# EAGLE design 1tm32 (EAGLE 9.6.2)
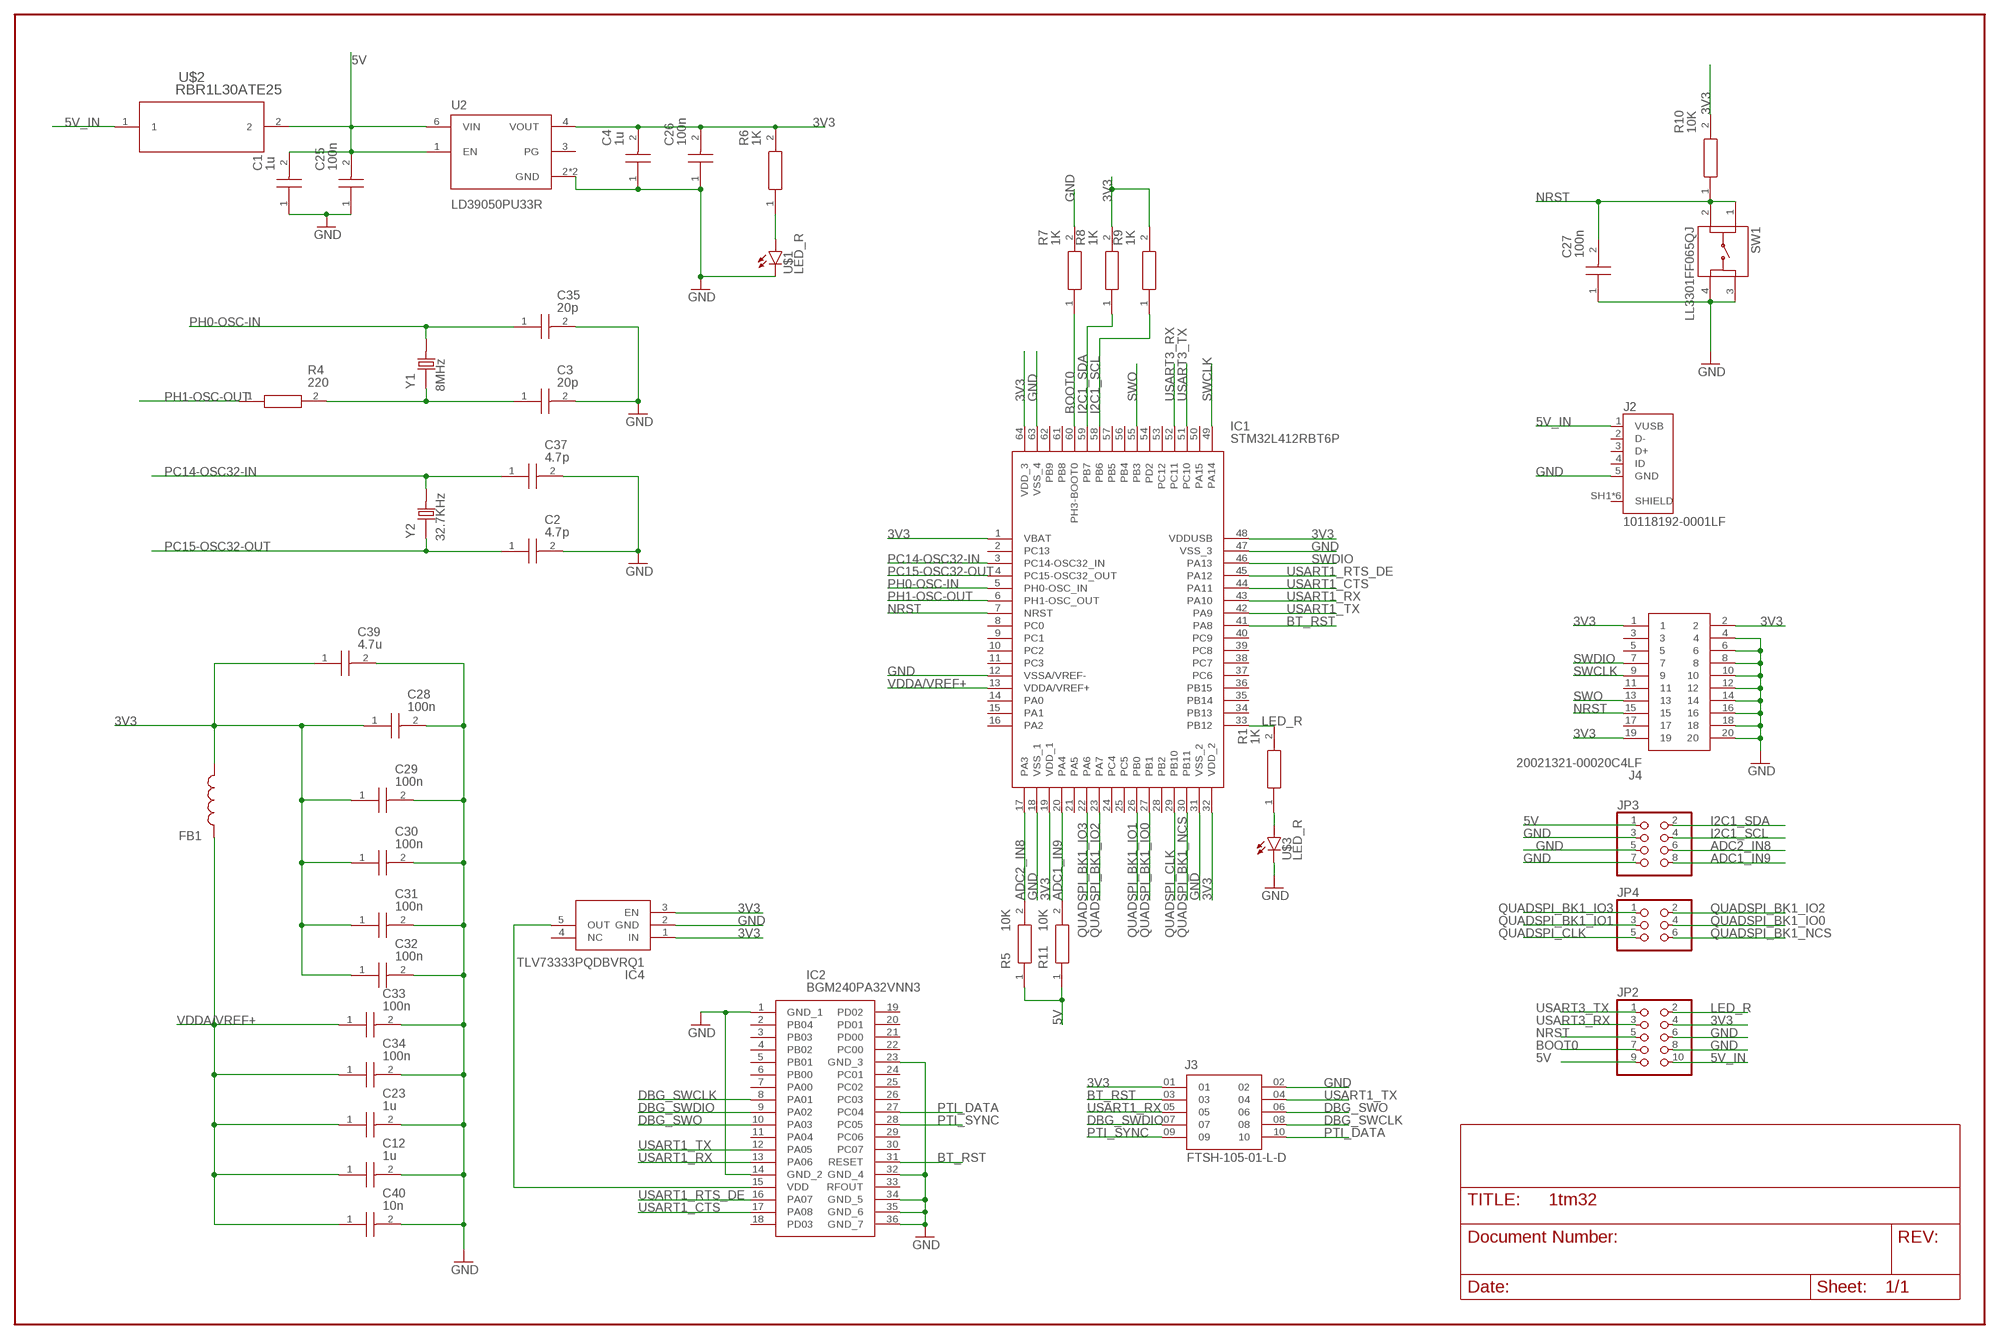
[diagram p0: schematic, sheet 1]

## Parts
C1  1u  GRM219R61H105KA73D  [CAPC2012X95N]
C2  4.7p  GQM2195C2E4R7BB12D  [CAPC2012X100N]
C3  20p  GQM2195G2H200GB12D  [CAPC2012X100N]
C4  1u  GRM219R61H105KA73D  [CAPC2012X95N]
C12  1u  GRM219R61H105KA73D  [CAPC2012X95N]
C23  1u  GRM219R61H105KA73D  [CAPC2012X95N]
C25  100n  GRT31C5C2A104JA12L  [CAPC3216X180N]
C26  100n  GRT31C5C2A104JA12L  [CAPC3216X180N]
C27  100n  GRT31C5C2A104JA12L  [CAPC3216X180N]
C28  100n  GRT31C5C2A104JA12L  [CAPC3216X180N]
C29  100n  GRT31C5C2A104JA12L  [CAPC3216X180N]
C30  100n  GRT31C5C2A104JA12L  [CAPC3216X180N]
C31  100n  GRT31C5C2A104JA12L  [CAPC3216X180N]
C32  100n  GRT31C5C2A104JA12L  [CAPC3216X180N]
C33  100n  GRT31C5C2A104JA12L  [CAPC3216X180N]
C34  100n  GRT31C5C2A104JA12L  [CAPC3216X180N]
C35  20p  GQM2195G2H200GB12D  [CAPC2012X100N]
C37  4.7p  GQM2195C2E4R7BB12D  [CAPC2012X100N]
C39  4.7u  GRT21BC71H475KE13L  [CAPC2012X145N]
C40  10n  GRM31CR73A103KW03L  [CAPC3216X180N]
FB1  BK1608HS601-T  [BEADC1608X95N]
IC1  STM32L412RBT6P  [QFP50P1200X1200X160-64N]
IC2  BGM240PA32VNN3  [BGM240PA32VNN3]
IC4  TLV73333PQDBVRQ1  [SOT95P280X145-5N]
J2  10118192-0001LF  [AMPHENOL_10118192-0001LF]
J3  FTSH-105-01-L-D  [SAMTEC_FTSH-105-01-L-D]
J4  20021321-00020C4LF  [2002132100020C4LF]
JP2  PINHD-2X5  [2X05]
JP3  PINHD-2X4  [2X04]
JP4  PINHD-2X3  [2X03]
R1  1K  RC0805FR-131KL  [RESC2012X60N]
R4  220  RC0805FR-10220RL  [RESC2012X60N]
R5  10K  RC0805JR-0710KL  [RESC2012X60N]
R6  1K  RC0805FR-131KL  [RESC2012X60N]
R7  1K  RC0805FR-131KL  [RESC2012X60N]
R8  1K  RC0805FR-131KL  [RESC2012X60N]
R9  1K  RC0805FR-131KL  [RESC2012X60N]
R10  10K  RC0805JR-0710KL  [RESC2012X60N]
R11  10K  RC0805JR-0710KL  [RESC2012X60N]
SW1  LL3301FF065QJ  [LL3301FF065QJ]
U2  LD39050PU33R  [SON95P300X300X100-7N]
U$1  LED_R  SML-P12VTT86  [LED_SML-P11UTT86R]
U$2  RBR1L30ATE25  [DIO_RBR1L30_ROM]
U$3  LED_R  SML-P12VTT86  [LED_SML-P11UTT86R]
Y1  8MHz  ABLS-8.000MHZ-B2-T  [XTAL_ABLS-8.000MHZ-B2-T]
Y2  32.7KHz  ECS-.327-12.5-12QS-TR  [XTAL_ECS-.327-12.5-12QS-TR]

## Nets
3V3: C4.2 C26.2 C28.1 C29.1 C30.1 C31.1 C32.1 C39.1 FB1.2 IC1.1(VBAT) IC1.19(VDD_1) IC1.32(VDD_2) IC1.48(VDDUSB) IC1.64(VDD_3) IC4.1(IN) IC4.3(EN) J3.01 J4.1 J4.2 J4.19 JP2.4 R6.2 R8.2 R9.2 R10.2 U2.4(VOUT)
5V: C1.2 C25.2 JP2.9 JP3.1 R5.1 R11.1 U2.1(EN) U2.6(VIN) U$2.2
5V_IN: J2.1(VUSB) JP2.10 U$2.1
ADC1_IN9: IC1.20(PA4) JP3.8 R11.2
ADC2_IN8: IC1.17(PA3) JP3.6 R5.2
BOOT0: IC1.60(PH3-BOOT0) JP2.7 R7.1
BT_RST: IC1.41(PA8) IC2.31(RESET) J3.03
DBG_SWCLK: IC2.8(PA01) J3.08
DBG_SWDIO: IC2.9(PA02) J3.07
DBG_SWO: IC2.10(PA03) J3.06
GND: C1.1 C2.2 C3.2 C4.1 C12.2 C23.2 C25.1 C26.1 C27.1 C28.2 C29.2 C30.2 C31.2 C32.2 C33.2 C34.2 C35.2 C37.2 C39.2 C40.2 IC1.12(VSSA/VREF-) IC1.18(VSS_1) IC1.31(VSS_2) IC1.47(VSS_3) IC1.63(VSS_4) IC2.1(GND_1) IC2.14(GND_2) IC2.23(GND_3) IC2.32(GND_4) IC2.34(GND_5) IC2.35(GND_6) IC2.36(GND_7) IC4.2(GND) J2.5(GND) J3.02 J4.4 J4.6 J4.8 J4.10 J4.12 J4.14 J4.16 J4.18 J4.20 JP2.6 JP2.8 JP3.3 JP3.5 JP3.7 R7.2 SW1.3 SW1.4 U2.2(GND) U2.7(GND) U$1.C U$3.C
I2C1_SCL: IC1.58(PB6) JP3.4 R9.1
I2C1_SDA: IC1.59(PB7) JP3.2 R8.1
LED_R: IC1.33(PB12) JP2.2 R1.2
N$2: R1.1 U$3.A
N$3: C3.1 R4.2 Y1.1
N$4: IC2.15(VDD) IC4.5(OUT)
N$5: R6.1 U$1.A
NRST: C27.2 IC1.7(NRST) J4.15 JP2.5 R10.1 SW1.1 SW1.2
PC14-OSC32-IN: C37.1 IC1.3(PC14-OSC32_IN) Y2.2
PC15-OSC32-OUT: C2.1 IC1.4(PC15-OSC32_OUT) Y2.1
PH0-OSC-IN: C35.1 IC1.5(PH0-OSC_IN) Y1.2
PH1-OSC-OUT: IC1.6(PH1-OSC_OUT) R4.1
PTI_DATA: IC2.27(PC04) J3.10
PTI_SYNC: IC2.28(PC05) J3.09
QUADSPI_BK1_IO0: IC1.27(PB1) JP4.4
QUADSPI_BK1_IO1: IC1.26(PB0) JP4.3
QUADSPI_BK1_IO2: IC1.23(PA7) JP4.2
QUADSPI_BK1_IO3: IC1.22(PA6) JP4.1
QUADSPI_BK1_NCS: IC1.30(PB11) JP4.6
QUADSPI_CLK: IC1.29(PB10) JP4.5
SWCLK: IC1.49(PA14) J4.9
SWDIO: IC1.46(PA13) J4.7
SWO: IC1.55(PB3) J4.13
USART1_CTS: IC1.44(PA11) IC2.17(PA08)
USART1_RTS_DE: IC1.45(PA12) IC2.16(PA07)
USART1_RX: IC1.43(PA10) IC2.13(PA06) J3.05
USART1_TX: IC1.42(PA9) IC2.12(PA05) J3.04
USART3_RX: IC1.52(PC11) JP2.3
USART3_TX: IC1.51(PC10) JP2.1
VDDA/VREF+: C12.1 C23.1 C33.1 C34.1 C40.1 FB1.1 IC1.13(VDDA/VREF+)
Unconnected: IC1.2(PC13) IC1.8(PC0) IC1.9(PC1) IC1.10(PC2) IC1.11(PC3) IC1.14(PA0) IC1.15(PA1) IC1.16(PA2) IC1.21(PA5) IC1.24(PC4) IC1.25(PC5) IC1.28(PB2) IC1.34(PB13) IC1.35(PB14) IC1.36(PB15) IC1.37(PC6) IC1.38(PC7) IC1.39(PC8) IC1.40(PC9) IC1.50(PA15) IC1.53(PC12) IC1.54(PD2) IC1.56(PB4) IC1.57(PB5) IC1.61(PB8) IC1.62(PB9) IC2.2(PB04) IC2.3(PB03) IC2.4(PB02) IC2.5(PB01) IC2.6(PB00) IC2.7(PA00) IC2.11(PA04) IC2.18(PD03) IC2.19(PD02) IC2.20(PD01) IC2.21(PD00) IC2.22(PC00) IC2.24(PC01) IC2.25(PC02) IC2.26(PC03) IC2.29(PC06) IC2.30(PC07) IC2.33(RFOUT) IC4.4(NC) J2.2(D-) J2.3(D+) J2.4(ID) J2.SH1(SHIELD) J2.SH2(SHIELD) J2.SH3(SHIELD) J2.SH4(SHIELD) J2.SH5(SHIELD) J2.SH6(SHIELD) J4.3 J4.5 J4.11 J4.17 U2.3(PG)

## Library data of the parts
C1 C4 C12 C23 = GRM219R61H105KA73D(1u):GRM219R61H105KA73D: MURATA - GRM219R61H105KA73D - CAP, MLCC, X5R, 1UF, 50V, 0805 Source: Datasheet <https://datasheet.datasheetarchive.com/originals/distributors/DKDS-10/191852.pdf>; DESCRIPTION: MURATA - GRM219R61H105KA73D - CAP, MLCC, X5R, 1UF, 50V, 0805; HEIGHT: 0.95mm; MANUFACTURER_NAME: Murata Electronics; MANUFACTURER_PART_NUMBER: GRM219R61H105KA73D; MOUSER_PART_NUMBER: 81-GRM219R61H105KA3D; MOUSER_PRICE-STOCK: https://www.mouser.co.uk/ProductDetail/Murata-Electronics/GRM219R61H105KA73D?qs=O5cugoO6nweiD1nCQ5vS9w%3D%3D
C2 C37 = GQM2195C2E4R7BB12D(4_7p):GQM2195C2E4R7BB12D: Capacitor GQM21 L=2.0mm W=1.25mm T=0.85mm Source: Datasheet <https://psearch.en.murata.com/capacitor/product/GQM2195C2E4R7BB12#.html>; DESCRIPTION: Capacitor GQM21 L=2.0mm W=1.25mm T=0.85mm; HEIGHT: 1mm; MANUFACTURER_NAME: Murata Electronics; MANUFACTURER_PART_NUMBER: GQM2195C2E4R7BB12D; MOUSER_PART_NUMBER: 81-GQM2195C2E4R7BB2D; MOUSER_PRICE-STOCK: https://www.mouser.co.uk/ProductDetail/Murata-Electronics/GQM2195C2E4R7BB12D?qs=0JbGSuRBwBOIE8NOw5EJ%2FA%3D%3D
C3 C35 = GQM2195G2H200GB12D(20p):GQM2195G2H200GB12D: Capacitor GQM21 L=2.0mm W=1.25mm T=0.85mm Source: Datasheet <https://componentsearchengine.com/Datasheets/1/GQM2195G2H200GB12D.pdf>; DESCRIPTION: Capacitor GQM21 L=2.0mm W=1.25mm T=0.85mm; HEIGHT: 1mm; MANUFACTURER_NAME: Murata Electronics; MANUFACTURER_PART_NUMBER: GQM2195G2H200GB12D; MOUSER_PART_NUMBER: 81-GQM2195G2H200GB2D; MOUSER_PRICE-STOCK: https://www.mouser.com/Search/Refine.aspx?Keyword=81-GQM2195G2H200GB2D
C25-C34 = GRT31C5C2A104JA12L(0_1u):GRT31C5C2A104JA12L: Multilayer Ceramic Capacitors MLCC - SMD/SMT Source: Datasheet <https://www.murata.com/en-eu/products/productdetail?partno=GRT31C5C2A104JA12#>; DESCRIPTION: Multilayer Ceramic Capacitors MLCC - SMD/SMT; HEIGHT: 1.8mm; MANUFACTURER_NAME: Murata Electronics; MANUFACTURER_PART_NUMBER: GRT31C5C2A104JA12L; MOUSER_PART_NUMBER: 81-GRT31C5C2A104JA2L; MOUSER_PRICE-STOCK: https://www.mouser.co.uk/ProductDetail/Murata-Electronics/GRT31C5C2A104JA12L?qs=rI7uf1IzohSpYGEFBFd58g%3D%3D
C39 = GRT21BC71H475KE13L(4_7u):GRT21BC71H475KE13L: GRT21BC71H475KE13_ (0805, X7S:EIA, 4.7uF, DC50V) Source: Datasheet <https://search.murata.co.jp/Ceramy/image/img/A01X/G101/ENG/GRT21BC71H475KE13-01.pdf>; DESCRIPTION: GRT21BC71H475KE13_ (0805, X7S:EIA, 4.7uF, DC50V); HEIGHT: 1.45mm; MANUFACTURER_NAME: Murata Electronics; MANUFACTURER_PART_NUMBER: GRT21BC71H475KE13L; MOUSER_PART_NUMBER: 81-GRT21BC71H475KE3L; MOUSER_PRICE-STOCK: https://www.mouser.co.uk/ProductDetail/Murata-Electronics/GRT21BC71H475KE13L?qs=rI7uf1IzohQrtwc9u30k7A%3D%3D
C40 = GRM31CR73A103KW03L(0_01u):GRM31CR73A103KW03L: Murata 3216 GRM 10000pF Ceramic Multilayer Capacitor, 1000 V dc, +125C, X7R Dielectric, +/-10% Source: Datasheet <https://datasheet.datasheetarchive.com/originals/distributors/DKDS-10/192419.pdf>; DESCRIPTION: Murata 3216 GRM 10000pF Ceramic Multilayer Capacitor, 1000 V dc, +125C, X7R Dielectric, +/-10%; HEIGHT: 1.8mm; MANUFACTURER_NAME: Murata Electronics; MANUFACTURER_PART_NUMBER: GRM31CR73A103KW03L; MOUSER_PART_NUMBER: 81-GRM31CR73A103KW3L; MOUSER_PRICE-STOCK: https://www.mouser.co.uk/ProductDetail/Murata-Electronics/GRM31CR73A103KW03L?qs=hNud%2FORuBR1TymPCs4fJcA%3D%3D
FB1 = ce-capstone:BK1608HS601-T: Ferrite Chip Bead(Lead Free) Source: Datasheet <https://www.tai-tech.com.tw/_upload/files/FCM1608-Series.pdf>; DESCRIPTION: Ferrite Chip Bead(Lead Free); HEIGHT: 0.95mm; MANUFACTURER_NAME: Taiyo Yuden; MANUFACTURER_PART_NUMBER: BK1608HS601-T
IC1 = STM32L412RBT6P:STM32L412RBT6P: ARM Microcontrollers - MCU Source: Datasheet <https://www.st.com/resource/en/datasheet/stm32l412c8.pdf>; DESCRIPTION: ARM Microcontrollers - MCU; HEIGHT: 1.6mm; MANUFACTURER_NAME: STMicroelectronics; MANUFACTURER_PART_NUMBER: STM32L412RBT6P; MOUSER_PART_NUMBER: 511-STM32L412RBT6P; MOUSER_PRICE-STOCK: https://www.mouser.co.uk/ProductDetail/STMicroelectronics/STM32L412RBT6P?qs=l7cgNqFNU1hh%252BU1wOZs5Xg%3D%3D
IC2 = BGM240PA32VNN3(bluetooth):BGM240PA32VNN3: Bluetooth Modules - 802.15.1 Bluetooth Module, PCB, Secure Vault Mid, +20 dBm, 2.4 GHz, 1.5 MB , -40 to 105 C, RF Pin, Production, Certified Source: Datasheet; DESCRIPTION: Bluetooth Modules - 802.15.1 Bluetooth Module, PCB, Secure Vault Mid, +20 dBm, 2.4 GHz, 1.5 MB , -40 to 105 C, RF Pin, Production, Certified; HEIGHT: 2.35mm; MANUFACTURER_NAME: Silicon Labs; MANUFACTURER_PART_NUMBER: BGM240PA32VNN3; MOUSER_PART_NUMBER: 634-BGM240PA32VNN3; MOUSER_PRICE-STOCK: https://www.mouser.co.uk/ProductDetail/Silicon-Labs/BGM240PA32VNN3?qs=vvQtp7zwQdOhCUYZDQ7aSw%3D%3D
IC4 = TLV73333PQDBVRQ1(volt_reg2):TLV73333PQDBVRQ1: Automotive capacitor-free 300-mA LDO regulator with foldback current limit for portable devices Source: Datasheet <http://www.ti.com/lit/gpn/TLV733P-Q1>; DESCRIPTION: Automotive capacitor-free 300-mA LDO regulator with foldback current limit for portable devices; HEIGHT: 1.45mm; MANUFACTURER_NAME: Texas Instruments; MANUFACTURER_PART_NUMBER: TLV73333PQDBVRQ1; MOUSER_PART_NUMBER: 595-TLV73333PQDBVRQ1; MOUSER_PRICE-STOCK: https://www.mouser.co.uk/ProductDetail/Texas-Instruments/TLV73333PQDBVRQ1?qs=9r4v7xj2LnnYANXVL3PB4Q%3D%3D
J2 = ce-capstone:10118192-0001LF: Single Port 5 Contact Horizontal Right Angle Shielded Micro B USB 2.0 Connector; AVAILABILITY: Unavailable; DESCRIPTION: USB - micro B USB 2.0 Receptacle Connector 5 Position Surface Mount, Right Angle; MF: Amphenol ICC; MP: 10118192-0001LF; PACKAGE: None; PRICE: None
J3 = FTSH-105-01-L-D(bt_connect):FTSH-105-01-L-D; MANUFACTURER: SAMTEC; PARTREV: B; STANDARD: Manufacturer Recommendations
J4 = 20021321-00020C4LF(20head):20021321-00020C4LF: Minitek127, Board to Board connectors, PCB mounted Receptacle, Vertical, Surface Mount, Double Row, 20 Positions, 1.27mm (0.05inch) pitch Source: Datasheet <https://cdn.amphenol-cs.com/media/wysiwyg/files/drawing/20021321.pdf>; DESCRIPTION: Minitek127, Board to Board connectors, PCB mounted Receptacle, Vertical, Surface Mount, Double Row, 20 Positions, 1.27mm (0.05inch) pitch; HEIGHT: 4.75mm; MANUFACTURER_NAME: Amphenol Communication Solutions; MANUFACTURER_PART_NUMBER: 20021321-00020C4LF; MOUSER_PART_NUMBER: 649-202132100020C4LF; MOUSER_PRICE-STOCK: https://www.mouser.co.uk/ProductDetail/Amphenol-FCI/20021321-00020C4LF?qs=iIVTEDlrHA2zvZ%252BdjBnqqg%3D%3D
JP2 = pinhead:PINHD-2X5: PIN HEADER
JP3 = pinhead:PINHD-2X4: PIN HEADER
JP4 = pinhead:PINHD-2X3: PIN HEADER
R1 R6-R9 = RC0805FR-131KL:RC0805FR-131KL: Thick Film Resistors - SMD 1 kOhms 250 mW 0805 1% Source: Datasheet <https://datasheet.datasheetarchive.com/originals/distributors/Datasheets_SAMA/902f9e387b938f871d31120f5fc1d65e.pdf>; DESCRIPTION: Thick Film Resistors - SMD 1 kOhms 250 mW 0805 1%; HEIGHT: 0.6mm; MANUFACTURER_NAME: KEMET; MANUFACTURER_PART_NUMBER: RC0805FR-131KL; MOUSER_PART_NUMBER: 603-RC0805FR-131KL; MOUSER_PRICE-STOCK: https://www.mouser.co.uk/ProductDetail/YAGEO/RC0805FR-131KL?qs=m6lXFsvg5e0qJLgmV7HC3Q%3D%3D
R4 = RC0805FR-10220RL:RC0805FR-10220RL: Thick Film Resistors - SMD 220 OHM 1% Source: Datasheet; DESCRIPTION: Thick Film Resistors - SMD 220 OHM 1%; HEIGHT: 0.6mm; MANUFACTURER_NAME: KEMET; MANUFACTURER_PART_NUMBER: RC0805FR-10220RL; MOUSER_PART_NUMBER: 603-RC0805FR-10220RL; MOUSER_PRICE-STOCK: https://www.mouser.co.uk/ProductDetail/YAGEO/RC0805FR-10220RL?qs=m6lXFsvg5e0JpfeoSKi9%252BQ%3D%3D
R5 R10 R11 = RC0805JR-0710KL:RC0805JR-0710KL: YAGEO - RC0805JR-0710KL - SMD Chip Resistor, 0805 [2012 Metric], 10 kohm, RC Series, 150 V, Thick Film, 125 mW Source: Datasheet <https://datasheet.datasheetarchive.com/originals/distributors/Datasheets_SAMA/902f9e387b938f871d31120f5fc1d65e.pdf>; DESCRIPTION: YAGEO - RC0805JR-0710KL - SMD Chip Resistor, 0805 [2012 Metric], 10 kohm, RC Series, 150 V, Thick Film, 125 mW; HEIGHT: 0.6mm; MANUFACTURER_NAME: KEMET; MANUFACTURER_PART_NUMBER: RC0805JR-0710KL; MOUSER_PART_NUMBER: 603-RC0805JR-0710KL; MOUSER_PRICE-STOCK: https://www.mouser.co.uk/ProductDetail/YAGEO/RC0805JR-0710KL?qs=ZFGQJeMQzF5q%2Fp77vM%2FrVQ%3D%3D
SW1 = ce-capstone:LL3301FF065QJ: Pushbutton Switches 50mA 12VDC F065 7.0mm J-Lead Source: Datasheet <https://componentsearchengine.com/Datasheets/1/LL3301FF065QJ.pdf>; DESCRIPTION: Pushbutton Switches 50mA 12VDC F065 7.0mm J-Lead; HEIGHT: 7.3mm; MANUFACTURER_NAME: E-Switch; MANUFACTURER_PART_NUMBER: LL3301FF065QJ; MOUSER_PART_NUMBER: 612-LL3301FF065QJ; MOUSER_PRICE-STOCK: https://www.mouser.com/Search/Refine.aspx?Keyword=612-LL3301FF065QJ
U2 = ce-capstone:LD39050PU33R: LD39050 Series 500 mA 3.3 V Fixed Low Noise LDO Voltage Regulator - DFN-6; AVAILABILITY: Unavailable; DESCRIPTION: Linear Voltage Regulator IC 1 Output 500mA 6-DFN _3x3_; MF: STMicroelectronics; MP: LD39050PU33R; PACKAGE: DFN-6 STMicroelectronics; PRICE: None
U$1 U$3 = ce-capstone:SML-P12VTT86: SML-P1 Series Red 0402 Clear 60 mcd 2 V Surface Mount PICOLED LED; AVAILABILITY: Unavailable; DESCRIPTION: Red 630nm LED Indication - Discrete 2V 0402 _1006 Metric_; MF: Rohm; MP: SML-P12VTT86; PACKAGE: 0402 Rohm; PRICE: None
U$2 = RBR1L30ATE25(scho_diode):RBR1L30ATE25; COPYRIGHT: Copyright (C) 2023 Ultra Librarian. All rights reserved.; DIGI-KEY_PART_NUMBER_1: RBR1L30ATE25CT-ND; DIGI-KEY_PART_NUMBER_2: RBR1L30ATE25DKR-ND; DIGI-KEY_PART_NUMBER_3: RBR1L30ATE25TR-ND; MANUFACTURER_PART_NUMBER: RBR1L30ATE25; MFR_NAME: ROHM Semiconductor
Y1 = ce-capstone:ABLS-8.000MHZ-B2-T: Crystal 8MHz Â±20ppm (Tol) Â±50ppm (Stability) 18pF FUND 80Ohm 2-Pin HC-49/US SMD T/R; AVAILABILITY: Unavailable; DESCRIPTION: 8MHz ±20ppm Crystal 18pF 80 Ohms HC-49/US; MF: Abracon LLC; MP: ABLS-8.000MHZ-B2; PACKAGE: HC-49/US Abracon LLC; PRICE: None
Y2 = ce-capstone:ECS-.327-12.5-12QS-TR: SMD CRYSTAL 32.768 KHz; AVAILABILITY: Unavailable; DESCRIPTION: 32.768kHz ±20ppm Crystal 12.5pF 90 kOhms 2-SMD, No Lead; MF: ECS Inc.; MP: ECS-.327-12.5-12QS-TR; PACKAGE: SMD-2 ECS International; PRICE: None

## Board
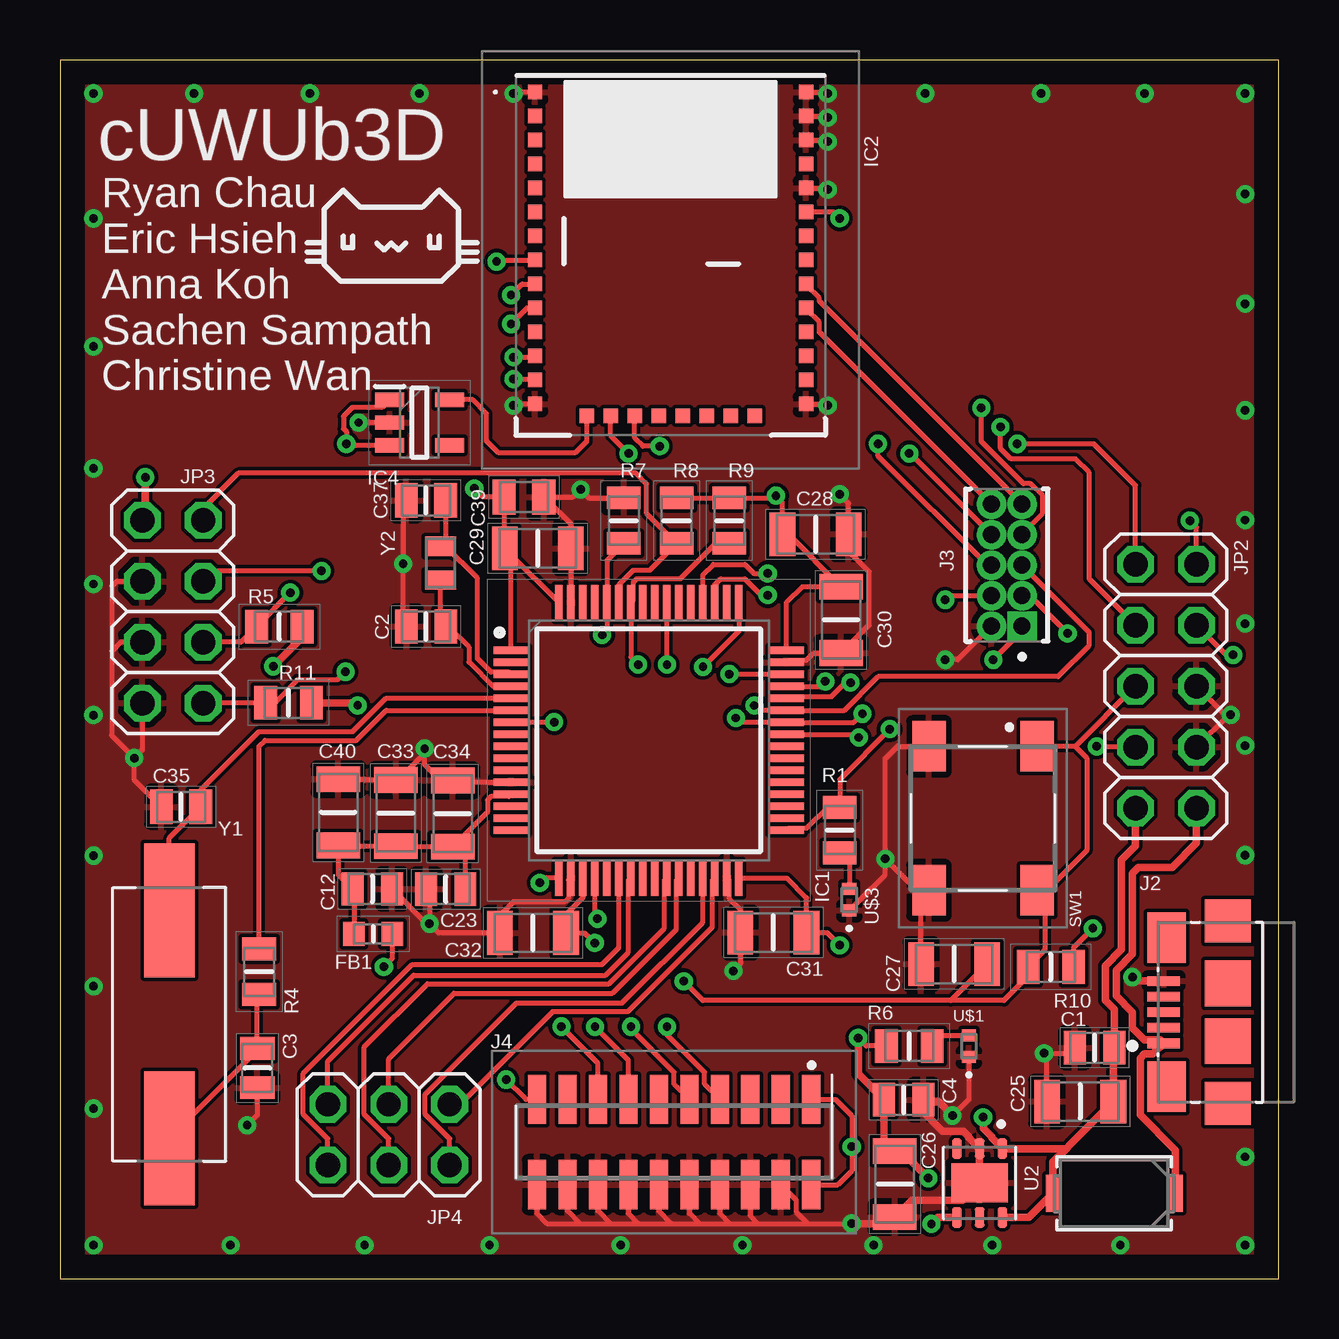
[diagram p1: board, top side]
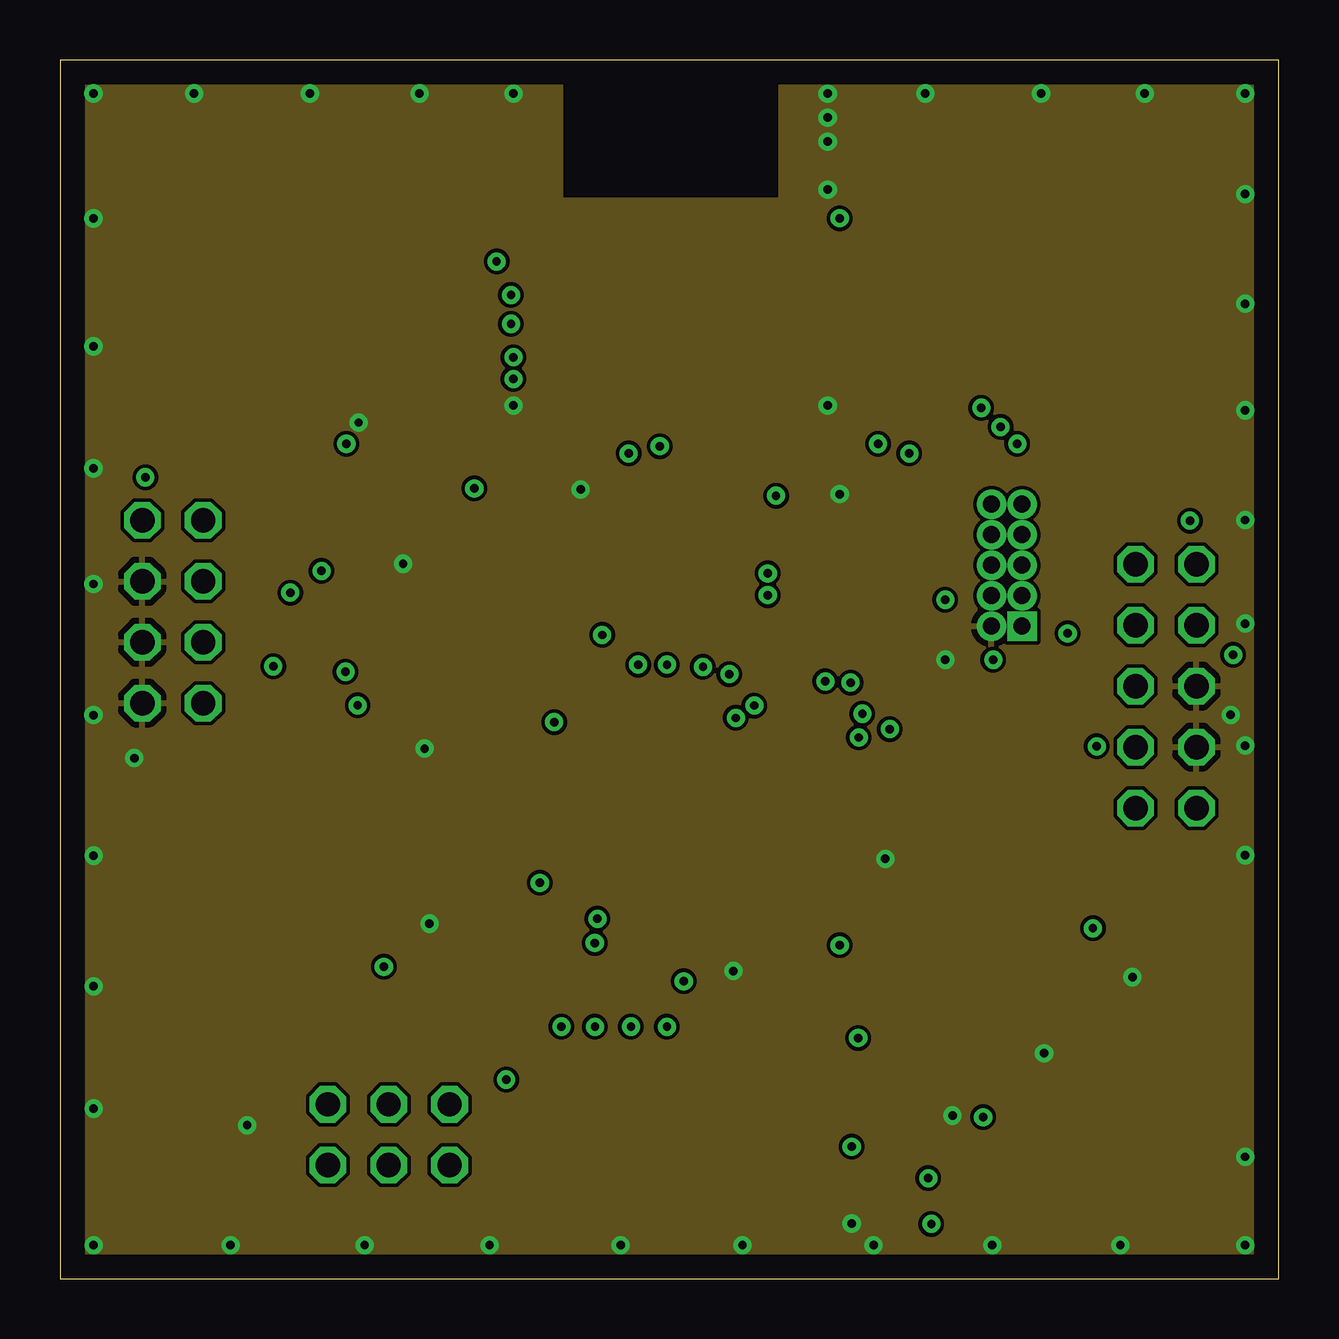
[diagram p2: board, inner layer Route2]
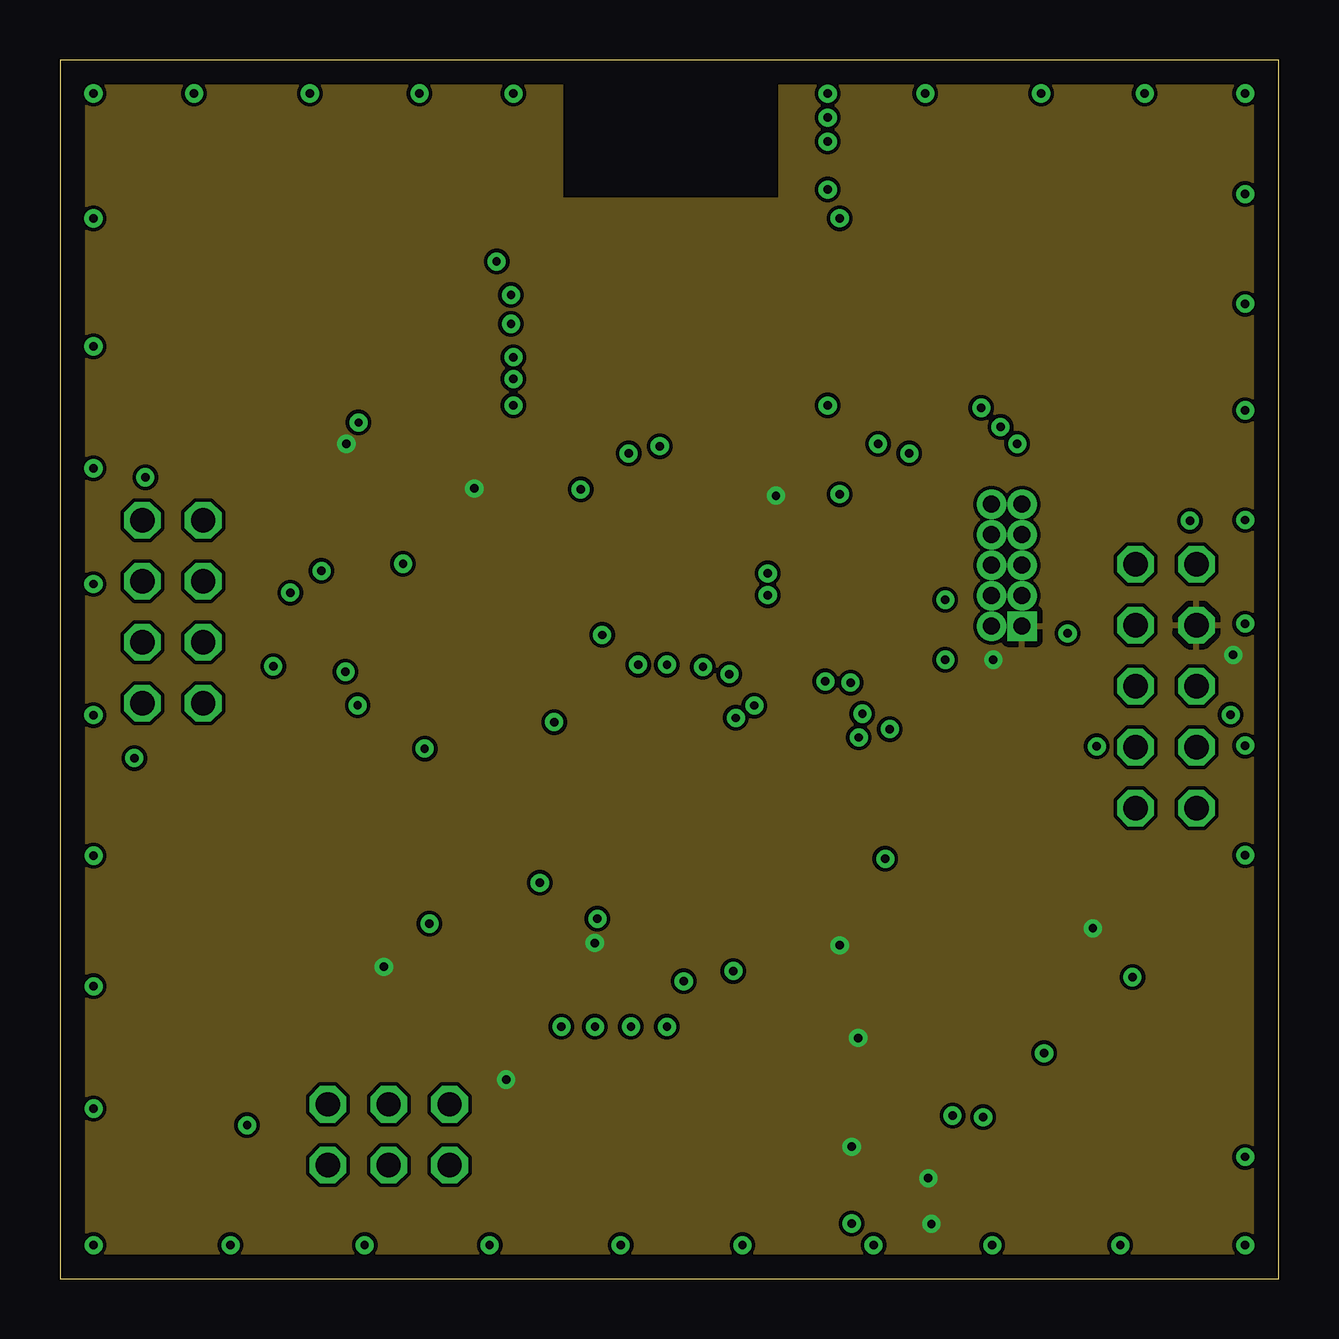
[diagram p3: board, inner layer Route15]
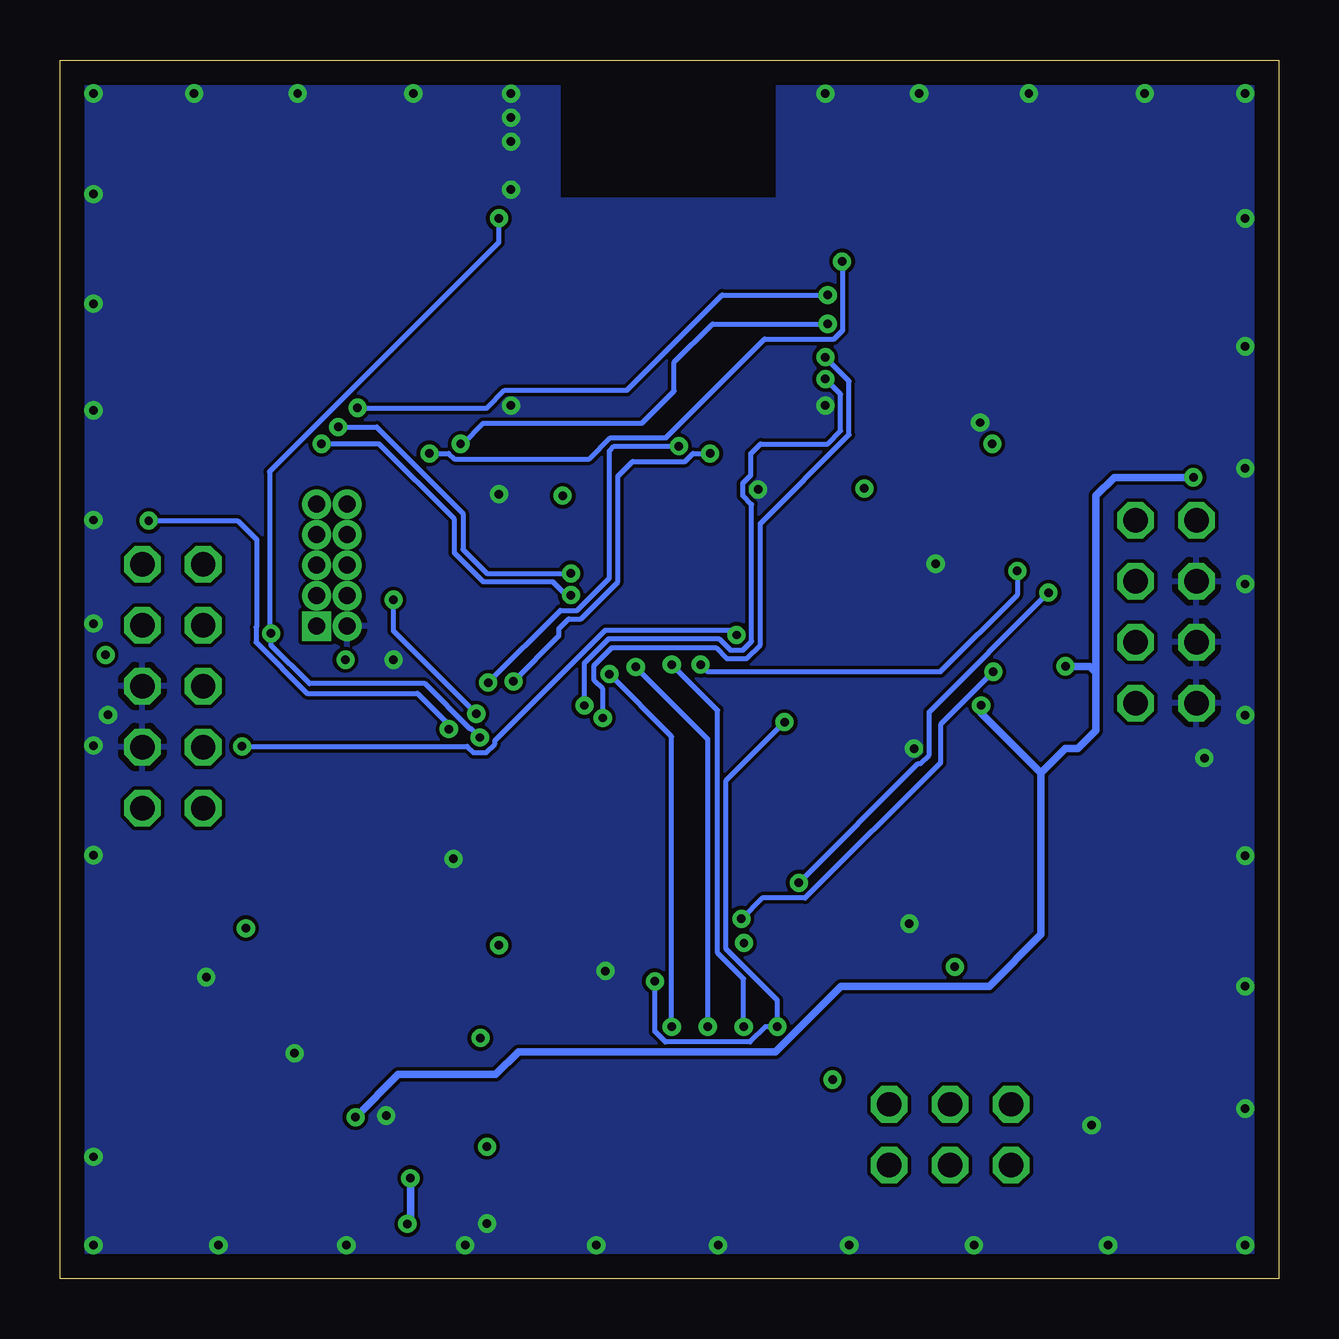
[diagram p4: board, bottom side, seen from below]

Size 50.8 x 50.8 mm. Coordinates in mm from the lower left corner, seen from the top.
Outline: 0,0 50.8,0 50.8,50.8 0,50.8 0,0
Copper layers (1+2*15+16): Top 0.035mm / dielectric 1.5mm / Route2 0.035mm / dielectric 0.15mm / Route15 0.035mm / dielectric 0.2mm / Bottom 0.035mm
Design rules "default *": minimum track width 8mil, minimum drill 0.35mm, track to track 6mil, track to pad 6mil, pad to pad 6mil, via to via 6mil, smd to smd 6mil, copper to edge 40mil, drill to drill 6mil, minimum pad ring 10mil, minimum via ring 8mil, stop-mask expansion 4mil, vias tented up to drill 0mil, thermal gap 10mil

### Footprints (pad centres in the part's own frame; a part is rotated, then mirrored left to right if it is on the bottom)
CAPC2012X95N = smd 0.91 x 1.39: 1 -0.82,0; 2 0.82,0
CAPC2012X100N = smd 0.94 x 1.43: 1 -0.82,0; 2 0.82,0
CAPC3216X180N = smd 1.07 x 1.82: 1 -1.38,0; 2 1.38,0
CAPC2012X145N = smd 0.97 x 1.47: 1 -0.83,0; 2 0.83,0
BEADC1608X95N = smd 0.9 x 1: 1 -0.8,0; 2 0.8,0
QFP50P1200X1200X160-64N = smd 1.475 x 0.3: 1 -5.738,3.75; 2 -5.738,3.25; 3 -5.738,2.75; 4 -5.738,2.25; 5 -5.738,1.75; 6 -5.738,1.25; 7 -5.738,0.75; 8 -5.738,0.25; 9 -5.738,-0.25; 10 -5.738,-0.75; 11 -5.738,-1.25; 12 -5.738,-1.75; 13 -5.738,-2.25; 14 -5.738,-2.75; 15 -5.738,-3.25; 16 -5.738,-3.75; 33 5.738,-3.75; 34 5.738,-3.25; 35 5.738,-2.75; 36 5.738,-2.25; 37 5.738,-1.75; 38 5.738,-1.25; 39 5.738,-0.75; 40 5.738,-0.25; 41 5.738,0.25; 42 5.738,0.75; 43 5.738,1.25; 44 5.738,1.75; 45 5.738,2.25; 46 5.738,2.75; 47 5.738,3.25; 48 5.738,3.75 | smd 0.3 x 1.475: 17 -3.75,-5.738; 18 -3.25,-5.738; 19 -2.75,-5.738; 20 -2.25,-5.738; 21 -1.75,-5.738; 22 -1.25,-5.738; 23 -0.75,-5.738; 24 -0.25,-5.738; 25 0.25,-5.738; 26 0.75,-5.738; 27 1.25,-5.738; 28 1.75,-5.738; 29 2.25,-5.738; 30 2.75,-5.738; 31 3.25,-5.738; 32 3.75,-5.738; 49 3.75,5.738; 50 3.25,5.738; 51 2.75,5.738; 52 2.25,5.738; 53 1.75,5.738; 54 1.25,5.738; 55 0.75,5.738; 56 0.25,5.738; 57 -0.25,5.738; 58 -0.75,5.738; 59 -1.25,5.738; 60 -1.75,5.738; 61 -2.25,5.738; 62 -2.75,5.738; 63 -3.25,5.738; 64 -3.75,5.738
BGM240PA32VNN3 = smd 0.6 x 0.6: 1 -5.65,6.8; 2 -5.65,5.8; 3 -5.65,4.8; 4 -5.65,3.8; 5 -5.65,2.8; 6 -5.65,1.8; 7 -5.65,0.8; 8 -5.65,-0.2; 9 -5.65,-1.2; 10 -5.65,-2.2; 11 -5.65,-3.2; 12 -5.65,-4.2; 13 -5.65,-5.2; 14 -5.65,-6.2; 15 -3.5,-6.7; 16 -2.5,-6.7; 17 -1.5,-6.7; 18 -0.5,-6.7; 19 0.5,-6.7; 20 1.5,-6.7; 21 2.5,-6.7; 22 3.5,-6.7; 23 5.65,-6.2; 24 5.65,-5.2; 25 5.65,-4.2; 26 5.65,-3.2; 27 5.65,-2.2; 28 5.65,-1.2; 29 5.65,-0.2; 30 5.65,0.8; 31 5.65,1.8; 32 5.65,2.8; 33 5.65,3.8; 34 5.65,4.8; 35 5.65,5.8; 36 5.65,6.8
SOT95P280X145-5N = smd 1.2 x 0.6: 1 -1.25,0.95; 2 -1.25,0; 3 -1.25,-0.95; 4 1.25,-0.95; 5 1.25,0.95
AMPHENOL_10118192-0001LF = smd 0.4 x 1.35: 1 -1.3,0; 2 -0.65,0; 3 0,0; 4 0.65,0; 5 1.3,0 | smd 2.1 x 1.6: SH1 -3.1,-0.125; SH2 3.1,-0.125 | smd 1.8 x 1.9: SH3 -3.8,-2.675; SH6 3.8,-2.675 | smd 1.9 x 1.9: SH4 -1.2,-2.675; SH5 1.2,-2.675
SAMTEC_FTSH-105-01-L-D = drill 0.71 pad 1.06 square: 01 0,0 | drill 0.71 pad 1.06: 02 0,1.27; 03 1.27,0; 04 1.27,1.27; 05 2.54,0; 06 2.54,1.27; 07 3.81,0; 08 3.81,1.27; 09 5.08,0; 10 5.08,1.27
2002132100020C4LF = smd 0.76 x 2.05: 1 5.715,1.775; 2 5.715,-1.775; 3 4.445,1.775; 4 4.445,-1.775; 5 3.175,1.775; 6 3.175,-1.775; 7 1.905,1.775; 8 1.905,-1.775; 9 0.635,1.775; 10 0.635,-1.775; 11 -0.635,1.775; 12 -0.635,-1.775; 13 -1.905,1.775; 14 -1.905,-1.775; 15 -3.175,1.775; 16 -3.175,-1.775; 17 -4.445,1.775; 18 -4.445,-1.775; 19 -5.715,1.775; 20 -5.715,-1.775
2X05 = drill 1.016 octagon: 1 -5.08,-1.27; 2 -5.08,1.27; 3 -2.54,-1.27; 4 -2.54,1.27; 5 0,-1.27; 6 0,1.27; 7 2.54,-1.27; 8 2.54,1.27; 9 5.08,-1.27; 10 5.08,1.27
2X04 = drill 1.016 octagon: 1 -3.81,-1.27; 2 -3.81,1.27; 3 -1.27,-1.27; 4 -1.27,1.27; 5 1.27,-1.27; 6 1.27,1.27; 7 3.81,-1.27; 8 3.81,1.27
2X03 = drill 1.016 octagon: 1 -2.54,-1.27; 2 -2.54,1.27; 3 0,-1.27; 4 0,1.27; 5 2.54,-1.27; 6 2.54,1.27
RESC2012X60N = smd 0.95 x 1.4: 1 -0.95,0; 2 0.95,0
LL3301FF065QJ = smd 2.1 x 1.4: 1 -3,2.25; 2 3,2.25; 3 -3,-2.25; 4 3,-2.25
SON95P300X300X100-7N = smd 0.84 x 0.4: 1 -1.435,0.95; 2 -1.435,0; 3 -1.435,-0.95; 4 1.435,-0.95; 5 1.435,0; 6 1.435,0.95 | smd 1.625 x 2.365: 7 0,0
LED_SML-P11UTT86R = smd 0.5 x 0.6: A 0.45,0; C -0.45,0
DIO_RBR1L30_ROM = smd 0.61 x 1.549: 1 -2.553,0; 2 2.553,0
XTAL_ABLS-8.000MHZ-B2-T = smd 5.6 x 2.1: 1 -4.75,0; 2 4.75,0
XTAL_ECS-.327-12.5-12QS-TR = smd 0.8 x 1.3: 1 -0.7,0; 2 0.7,0

### Placement (x,y rotation side)
C1  43.12,9.63 0 top
C2  15.26,27.19 180 top
C3  8.23,8.78 270 top
C4  35.17,7.46 180 top
C12  13.02,16.25 0 top
C23  16.08,16.24 180 top
C25  42.52,7.39 0 top
C26  34.8,3.95 90 top
C27  37.27,13.12 0 top
C28  31.49,31.03 0 top
C29  19.92,30.44 0 top
C30  32.56,27.46 270 top
C31  29.74,14.43 180 top
C32  19.71,14.41 180 top
C33  14,19.41 90 top
C34  16.37,19.39 90 top
C35  5.04,19.67 180 top
C37  15.25,32.44 180 top
C39  19.34,32.58 0 top
C40  11.6,19.44 90 top
FB1  13.05,14.37 0 top
IC1  24.54,22.44 0 top
IC2  25.45,42.66 0 top
IC4  14.99,35.69 0 top
J2  46,11.11 90 top
J3  40.1,27.2 90 top
J4  25.6,5.7 0 top
JP2  46.1,24.7 270 top
JP3  4.7,27.8 270 top
JP4  13.7,6 0 top
R1  32.5,18.7 90 top
R4  8.3,12.8 270 top
R5  9.14,27.18 180 top
R6  35.4,9.7 180 top
R7  23.5,31.6 90 top
R8  25.7,31.6 90 top
R9  27.9,31.6 90 top
R10  41.3,13 0 top
R11  9.53,24 180 top
SW1  38.48,19.19 270 top
U2  38.33,3.99 270 top
U$1  37.89,9.7 90 top
U$2  43.94,3.56 180 top
U$3  32.9,15.8 90 top
Y1  4.56,10.6 90 top
Y2  15.87,29.83 90 top

### Tracks (layer width: path | path; a pad name or v marks a point on that pad's centre or on a via)
3V3  (via drill 0.35)
  Top 0.203: J4.2 32.42,3.92 33,4.5 v33,5.5 33,6.79 32.31,7.47 J4.1 | J4.19 19.43,7.47 v18.6,8.3 | 34.8,5.2 C26.2 | IC1.19 21.79,15.89 21.09,15.2 C32.1 21.87,14.41 v22.29,13.99 | IC1.32 30.29,16.7 31.12,15.88 C31.1 31.97,14.43 v32.5,13.9 | IC1.48 30.28,28.18 30.94,28.84 C30.1 30.37,31.03 C28.1 30.11,32.37 v29.84,32.64 29.76,32.55 R9.2 R8.2 | J3.01 40.1,27 v38.9,25.8 | FB1.2 13.85,13.35 v13.5,13 | JP2.4 48.61,26 v48.9,26 | R6.2 33.61,9.7 v33.27,10.03 | R10.2 42.25,13.8 v43.05,14.61 | IC1.64 18.8,30.17 | v17.27,32.94 17.63,32.58 C39.1 18.51,30.47 C29.1 18.8,30.17 | IC1.1 18.8,30.17 | IC4.3 12,34.74 v11.94,34.8 11.94,35.3 11.81,35.42 11.81,35.95 12.18,36.32 13.42,36.32 IC4.1
  Top 0.305: v33.27,10.03 33.27,8.53 C4.2 34.35,5.55 34.8,5.1 34.8,5.2 35.19,5.2 v36.2,4.19 | U2.4 36.59,2.55 v36.32,2.29
  Bottom 0.305: v36.32,2.29 36.2,2.41 v36.2,4.19
  pour Route15: 0,50.8 20.9,50.8 20.9,45 30,45 30,50.8 50.8,50.8 50.8,0 0,0
5V  (via drill 0.35)
  Top 0.305: 41.94,5.42 U2.1 38.84,5.87 38.84,5.91 38.48,6.27 v38.48,6.73 | 41.94,5.42 42.13,5.62 C25.2 43.9,9.59 C1.2 43.94,11.22 43.56,11.6 43.56,13.04 44.25,13.73 44.25,17.46 44.83,18.05 JP2.9 | v3.56,33.4 3.56,31.74 JP3.1 | R5.1 10.09,26.73 v8.89,25.53 | R11.1 12.3,24 v12.41,23.9 | U2.6 40.39,2.55 U$2.2 41.39,4.87 41.94,5.42
  Bottom 0.305: v38.48,6.73 36.7,8.51 32.64,8.51 31.69,9.46 20.98,9.46 18.25,12.19 12.06,12.19 9.91,14.35 9.91,21.08 | 9.91,21.08 12.41,23.58 v12.41,23.9 | 9.91,21.08 8.89,22.1 8.38,22.1 7.62,22.86 7.62,25.27 | 7.62,25.27 7.87,25.53 v8.89,25.53 | 7.62,25.27 7.62,32.64 6.86,33.4 v3.56,33.4
5V_IN
  Top 0.305: JP2.10 47.37,18.16 46.35,17.14 44.96,17.14 44.7,16.89 44.7,13.54 44.02,12.86 44.02,11.79 44.7,11.11 44.7,10.45 45.2,9.96 45.86,9.96 J2.1 45.56,9.37 45.2,9.37 45.02,9.19 45.02,6.83 46.49,5.36 U$2.1
ADC1_IN9  (via drill 0.35)
  Top 0.203: v22.4,15 22.29,15.11 IC1.20 | v11.9,25.3 11.56,24.96 9.89,24.96 8.94,24 R11.2 8.56,23.99 JP3.8
  Bottom 0.203: v11.9,25.3 14.1,23.1 14.1,21.51 19.74,15.87 21.53,15.87 v22.4,15
ADC2_IN8  (via drill 0.35)
  Top 0.203: IC1.17 20.2,16.7 v20,16.5 | v9.6,28.6 8.19,27.19 R5.2 7.55,26.53 JP3.6
  Bottom 0.203: v20,16.5 15.03,21.47 14.94,21.47 14.57,21.84 14.57,23.63 v9.6,28.6
BOOT0  (via drill 0.35)
  Top 0.203: R7.1 22.79,29.94 IC1.60 22.8,27.14 22.6,26.94 v22.6,26.83 | JP2.7 43.21,22.16 v43.21,22.19
  Bottom 0.203: v43.21,22.19 33.82,22.19 33.56,21.93 33.04,21.93 32.67,22.3 32.67,22.43 28.07,27.03 22.8,27.03 v22.6,26.83
BT_RST  (via drill 0.35)
  Top 0.203: IC1.41 33.17,22.69 v33.3,22.56 | v42,26.9 40.43,28.47 J3.03 | v32.5,44.2 32.24,44.46 IC2.31
  Bottom 0.203: v33.3,22.56 33.66,22.92 33.71,22.92 35.59,24.8 40.4,24.8 42,26.4 v42,26.9 42.06,26.96 42.06,33.64 32.5,43.2 v32.5,44.2
DBG_SWCLK  (via drill 0.35)
  Top 0.203: J3.08 35.44,34.4 v35.4,34.4 | v18.2,42.4 18.26,42.46 IC2.8
  Bottom 0.203: v35.4,34.4 34.59,34.4 34.36,34.17 28.73,34.17 27.85,35.06 25.54,35.06 21.43,39.17 18.54,39.17 18.17,39.54 18.17,42.37 v18.2,42.4
DBG_SWDIO  (via drill 0.35)
  Top 0.203: v38.4,36.3 38.4,34.9 40.16,33.14 40.46,33.14 40.96,32.64 40.96,31.92 40.1,31.06 J3.07 | v18.8,41 19.26,41.46 IC2.9
  Bottom 0.203: v38.4,36.3 32.99,36.3 32.26,37.03 27.17,37.03 23.2,41 v18.8,41
DBG_SWO  (via drill 0.35)
  Top 0.203: v34.1,34.8 34.1,34.29 38.65,29.74 J3.06 | v18.8,39.8 19.46,40.46 IC2.10
  Bottom 0.203: v34.1,34.8 34,34.8 33.14,35.66 26.54,35.66 25.2,37 25.2,38.2 23.6,39.8 v18.8,39.8
GND  (via drill 0.35)
  Top 0.203: IC2.36 31.94,49.46 v32,49.4 | IC2.35 31.94,48.46 v32,48.4 | IC2.34 31.94,47.46 v32,47.4 | IC2.32 31.94,45.46 v32,45.4 | IC2.23 31.94,36.46 v32,36.4 | IC2.14 18.96,36.46 v18.9,36.4 | IC2.1 18.96,49.46 v18.9,49.4 | C37.2 14.3,32.31 v14.3,29.8 14.3,27.33 C2.2 | U$1.C 37.89,7.49 v37.2,6.8 | IC1.63 C29.2 21.3,31.46 C39.2 21.38,32.58 v21.7,32.9 22.05,32.55 R7.2 | IC1.12 16.44,20.69 C34.2 15.87,20.77 15.2,21.43 15.2,21.89 | C40.2 11.63,20.79 C33.2 14.1,20.79 15.2,21.89 | C23.2 15.4,16.38 v15.4,14.8 | IC1.18 21.2,16.61 21.2,15.86 21.05,15.71 18.9,15.71 18.34,15.15 C32.2 15.79,14.41 v15.4,14.8 | IC1.31 27.89,16.61 27.89,15.86 28.36,15.39 C31.2 28.36,13.12 v28.07,12.83 | IC1.47 30.38,25.79 31.12,25.79 31.42,26.08 C30.2 33.72,27.25 33.72,29.48 32.87,30.33 C28.2 32.87,32.33 v32.5,32.7 | J4.4 30.68,3.29 30.68,2.79 31.18,2.3 | 31.18,2.3 v33,2.3 | C12.2 15.29,14.8 v15.4,14.8 | 15.2,21.89 v15.2,22.1 | JP3.7 3.43,22.03 v3.1,21.7 | C35.2 3.1,20.8 v3.1,21.7 | JP3.3 2.37,29.07 2.15,28.85 2.15,26.15 | 2.15,26.15 2.15,22.65 v3.1,21.7 | JP3.5 2.53,26.53 2.15,26.15 | J4.6 28.77,2.62 29.1,2.3 | 27.93,2.3 27.5,2.73 J4.8 | 29.1,2.3 31.18,2.3 | 26.66,2.3 26.23,2.73 J4.10 | 25.49,2.3 24.96,2.83 J4.12 | 24.12,2.3 23.7,2.73 J4.14 | J4.16 22.43,2.83 22.95,2.3 | 21.68,2.3 21.16,2.83 J4.18 | J4.20 19.89,2.73 20.31,2.3 21.68,2.3 | 21.68,2.3 22.95,2.3 | 22.95,2.3 24.12,2.3 | 24.12,2.3 25.49,2.3 | 25.49,2.3 26.66,2.3 | 26.66,2.3 27.93,2.3 | 27.93,2.3 29.1,2.3 | C3.2 8.23,6.83 v7.8,6.4 | U$3.C 33.3,15.75 34.4,16.84 v34.4,17.5 | C27.1 35.89,16.01 v34.4,17.5 | v34.4,17.5 35.71,16.19 SW1.4 | v34.4,17.5 34.4,21.69 34.9,22.19 SW1.3 | J3.02 37.43,25.8 v36.9,25.8
  Top 0.203: JP2.6 48.57,23.5 v48.8,23.5 48.71,23.5 JP2.8 | C25.1 41.14,9.28 v41.02,9.4 42.07,9.4 C1.1 | IC4.2 v12.45,35.69
  Top 0.305: J2.5 44.87,12.41 v44.7,12.57 | v33,2.3 34.53,2.3 C26.1 35.51,3.28 37.62,3.28 U2.7 U2.2 37.89,5.87 37.89,5.91 37.65,6.15 36.79,6.15 35.99,6.95 C4.1 36.08,7.37 36.63,7.37 v37.2,6.8
  other vias: 1.4,1.4 7.11,1.4 12.7,1.4 17.91,1.4 23.37,1.4 28.45,1.4 33.91,1.4 38.86,1.4 44.2,1.4 49.4,1.4 49.4,5.08 49.4,17.65 49.4,22.23 49.4,27.3 49.4,31.62 49.4,36.2 49.4,40.64 49.4,45.21 49.4,49.4 45.21,49.4 40.89,49.4 36.07,49.4 14.99,49.4 10.41,49.4 5.59,49.4 1.4,49.4 1.4,44.2 1.4,38.86 1.4,33.78 1.4,28.96 1.4,23.5 1.4,17.64 1.4,12.19 1.4,7.09
  pour Top: 0,50.8 20.9,50.8 20.9,45 30,45 30,50.8 50.8,50.8 50.8,0 0,0
  pour Bottom: 0,50.8 20.9,50.8 20.9,45 30,45 30,50.8 50.8,50.8 50.8,0 0,0
  pour Route2: 0,50.8 20.9,50.8 20.9,45 30,45 30,50.8 50.8,50.8 50.8,0 0,0
I2C1_SCL  (via drill 0.35)
  Top 0.203: R9.1 27.33,30.65 25.85,29.17 24.04,29.17 23.89,29.02 23.89,28.28 IC1.58 23.79,25.91 v24.1,25.6 | JP3.4 6.4,29.5 v10.9,29.5
  Bottom 0.203: v24.1,25.6 23.8,25.3 14.09,25.3 10.9,28.49 v10.9,29.5
I2C1_SDA
  Top 0.203: IC1.59 23.29,28.93 23.89,29.53 24.58,29.53 R8.1 24.45,31.9 24.45,33.13 24.01,33.57 7.43,33.57 5.97,32.11 JP3.2
LED_R  (via drill 0.35)
  Top 0.203: IC1.33 30.38,18.79 31.12,18.79 31.98,19.65 R1.2 32.5,20.82 v34.59,22.91 | JP2.2 47.37,31.33 v47.1,31.6
  Bottom 0.203: v47.1,31.6 43.4,31.6 42.6,30.8 42.6,27.19 42.63,27.16 42.63,26.53 40.5,24.4 35.9,24.4 34.59,23.09 v34.59,22.91
N$2
  Top 0.203: R1.1 32.9,17.35 U$3.A
N$3
  Top 0.203: Y1.1 8.23,9.52 C3.1 8.23,11.78 R4.2
N$4
  Top 0.203: IC2.15 21.95,34.9 21.46,34.42 18.29,34.42 17.78,34.92 17.78,36.07 17.21,36.64 IC4.5
N$5
  Top 0.203: R6.1 36.8,10.15 U$1.A
NRST  (via drill 0.35)
  Top 0.203: J4.15 22.43,8.98 v20.9,10.51 | v20.6,23.2 v20.59,23.19 IC1.7 | 37.13,11.6 39.35,11.6 40.35,12.6 R10.1 41.05,13.7 41.05,15.87 | C27.2 37.13,11.6 | 37.13,11.6 26.8,11.6 v26,12.4 | SW1.2 41.05,15.87 | 41.05,15.87 41.05,16.1 42.8,17.85 42.8,21.7 42.32,22.18 42.32,22.19 | 42.32,22.19 SW1.1 | JP2.5 42.32,22.19
  Bottom 0.203: v20.6,23.2 23.03,20.77 23.03,13.74 20.9,11.61 v20.9,10.51 21.4,10.51 22.04,9.87 25.56,9.87 26,10.31 v26,12.4
PC14-OSC32-IN
  Top 0.203: C37.1 16.07,30.73 Y2.2 16.07,30.53 17.4,29.2 17.4,25.85 17.96,25.29 18.71,25.29 IC1.3
PC15-OSC32-OUT
  Top 0.203: Y2.1 15.87,27.4 C2.1 16.18,27.19 17.04,26.32 17.04,25.7 18.05,24.69 IC1.4
PH0-OSC-IN
  Top 0.203: IC1.5 13.6,24.2 12.2,22.8 8.3,22.8 5.87,20.36 C35.1 4.56,18.36 Y1.2
PH1-OSC-OUT
  Top 0.203: R4.1 8.3,22.2 8.54,22.44 12.35,22.44 13.6,23.69 IC1.6
PTI_DATA
  Top 0.203: J3.10 31.65,39.46 31.65,39.87 31.1,40.42 IC2.27
PTI_SYNC
  Top 0.203: J3.09 40.1,32.31 31.65,40.75 31.65,40.87 31.1,41.42 IC2.28
QUADSPI_BK1_IO0
  Top 0.203: JP4.4 13.7,9.17 16.42,11.89 23.03,11.89 25.7,14.56 25.7,16.61 IC1.27
QUADSPI_BK1_IO1
  Top 0.203: JP4.3 13.7,5.83 12.68,6.85 12.68,9.66 15.32,12.29 22.88,12.29 25.2,14.61 25.2,16.61 IC1.26
QUADSPI_BK1_IO2
  Top 0.203: JP4.2 11.16,9.07 14.74,12.65 22.73,12.65 23.7,13.61 23.7,16.61 IC1.23
QUADSPI_BK1_IO3
  Top 0.203: JP4.1 11.16,5.83 10.14,6.85 10.14,8.56 14.69,13.1 22.59,13.1 23.29,13.81 IC1.22
QUADSPI_BK1_NCS
  Top 0.203: JP4.6 16.68,7.27 20.55,11.14 23.67,11.14 27.2,14.66 27.2,16.61 IC1.30
QUADSPI_CLK
  Top 0.203: IC1.29 26.79,14.85 23.43,11.49 19.03,11.49 15.22,7.69 15.22,6.85 16.24,5.83 JP4.5
SWCLK  (via drill 0.35)
  Top 0.203: J4.9 25.6,8.11 25.6,8.61 23.8,10.4 v23.8,10.51 | IC1.49 28.29,26.99 v26.8,25.5
  Bottom 0.203: v23.8,10.51 23.8,22.5 v26.8,25.5
SWDIO  (via drill 0.35)
  Top 0.203: J4.7 26.87,8.11 26.87,8.61 25.3,10.17 v25.3,10.5 | v27.9,25.2 IC1.46
  Bottom 0.203: v25.3,10.5 25.3,22.6 v27.9,25.2
SWO  (via drill 0.35)
  Top 0.203: J4.13 23.7,9.11 v22.3,10.5 | v25.3,25.6 IC1.55
  Bottom 0.203: v22.3,10.5 22.3,12.5 23.39,13.59 23.39,23.69 v25.3,25.6
USART1_CTS  (via drill 0.35)
  Top 0.203: v32.95,24.85 32.74,24.85 32.16,24.27 30.36,24.27 IC1.44 | v25,34.7 24.3,34.7 23.95,35.05 IC2.17
  Bottom 0.203: v32.95,24.85 29.94,27.86 29.24,27.86 27.9,29.2 27.9,34.5 27.7,34.7 v25,34.7
USART1_RTS_DE  (via drill 0.35)
  Top 0.203: IC1.45 31.69,24.69 v31.9,24.9 | v23.7,34.4 22.95,35.15 IC2.16
  Bottom 0.203: v31.9,24.9 30,26.8 30,27.1 29.6,27.5 29.09,27.5 27.54,29.05 27.54,33.46 26.93,34.07 24.74,34.07 24.41,34.4 v23.7,34.4
USART1_RX  (via drill 0.35)
  Top 0.203: J3.05 42.9,26.94 42.9,26.4 41.6,25.1 34.1,25.1 32.69,23.69 IC1.43 29.08,23.69 28.94,23.83 v28.94,23.89 | v18.9,37.5 19.76,37.5 IC2.13
  Bottom 0.203: v28.94,23.89 28.94,25.66 27.92,26.68 23.34,26.68 22.86,26.2 22.34,26.2 21.97,26.57 21.97,32.27 22.33,32.64 22.33,33.16 22,33.49 22,34.4 21.6,34.8 18.8,34.8 18.27,35.33 18.27,36.87 v18.9,37.5
USART1_TX  (via drill 0.35)
  Top 0.203: v33.45,23.55 33.09,23.19 IC1.42 28.36,23.19 v28.17,23.37 | v36.9,28.3 37.07,28.47 J3.04 | v18.9,38.41 19.75,38.41 IC2.12
  Bottom 0.203: v33.45,23.55 36.9,27.01 v36.9,28.3 | v28.17,23.37 28.17,24.58 28.53,24.94 28.53,25.56 27.79,26.3 23.46,26.3 23.01,25.84 22.19,25.84 21.61,26.42 21.61,31.48 17.91,35.19 17.91,37.41 18.9,38.39 v18.9,38.41
USART3_RX  (via drill 0.35)
  Top 0.203: IC1.52 26.79,29.32 27.24,29.77 28.55,29.77 28.92,29.4 v29.5,29.4 | JP2.3 42.9,29.17 42.9,33.6 42.33,34.17 39.64,34.17 39.2,34.61 v39.2,35.5
  Bottom 0.203: v39.2,35.5 37.6,35.5 34,31.9 34,30.4 33,29.4 v29.5,29.4
USART3_TX  (via drill 0.35)
  Top 0.203: IC1.51 27.29,28.92 27.54,29.17 28.55,29.17 29.23,28.49 v29.5,28.49 | JP2.1 44.83,33.07 43.1,34.8 v39.9,34.8
  Bottom 0.203: v29.5,28.49 29.7,28.49 30.25,29.04 33.15,29.04 34.36,30.25 34.36,31.66 37.5,34.8 v39.9,34.8
VDDA/VREF+
  Top 0.203: IC1.13 18.71,20.1 17.96,20.1 17.81,19.95 17.81,19.45 16.48,18.12 | 16.48,18.12 C34.1 14.02,18.01 C33.1 11.63,18.03 C40.1 11.6,16.85 C12.1 12.25,16.2 FB1.1 | C23.1 16.9,17.7 16.48,18.12

### Text on the board
tPlace: cUWUb3D | Ryan Chau / Eric Hsieh / Anna Koh / Sachen Sampath / Christine Wan